# EAGLE schematic isp (EAGLE 9.6.2)
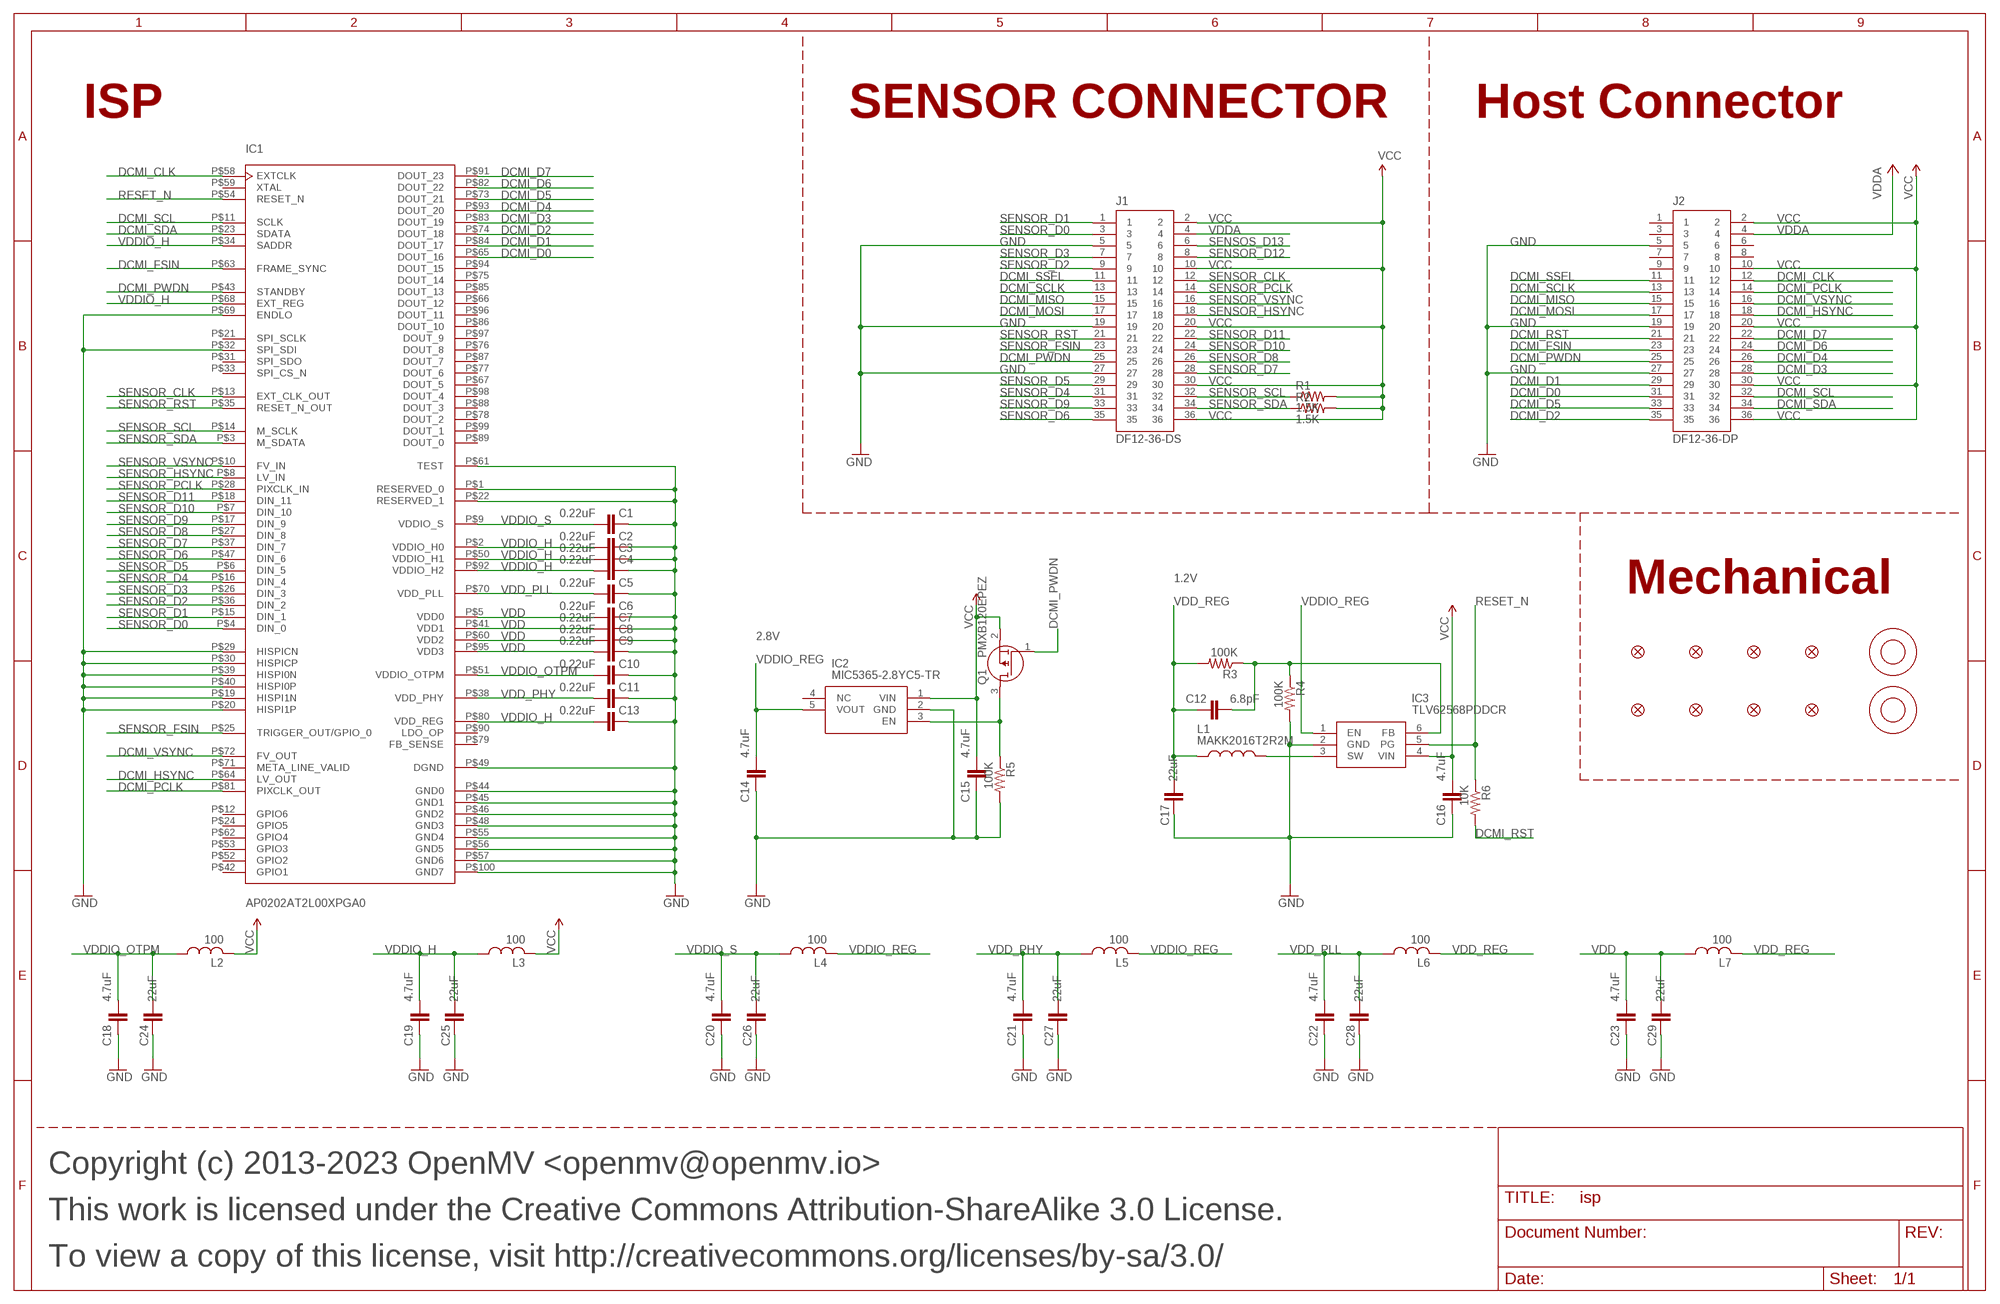
[diagram p0: schematic, sheet 1]

## Parts
C1  0.22uF  C-EUC0201  [C0201]
C2  0.22uF  C-EUC0201  [C0201]
C3  0.22uF  C-EUC0201  [C0201]
C4  0.22uF  C-EUC0201  [C0201]
C5  0.22uF  C-EUC0201  [C0201]
C6  0.22uF  C-EUC0201  [C0201]
C7  0.22uF  C-EUC0201  [C0201]
C8  0.22uF  C-EUC0201  [C0201]
C9  0.22uF  C-EUC0201  [C0201]
C10  0.22uF  C-EUC0201  [C0201]
C11  0.22uF  C-EUC0201  [C0201]
C12  6.8pF  CAP_0402  [0402]
C13  0.22uF  C-EUC0201  [C0201]
C14  4.7uF  CAP_0402  [0402]
C15  4.7uF  CAP_0402  [0402]
C16  4.7uF  CAP_0402  [0402]
C17  22uF  22UF-0805-6.3V-20%  [0805]
C18  4.7uF  CAP_0402  [0402]
C19  4.7uF  CAP_0402  [0402]
C20  4.7uF  CAP_0402  [0402]
C21  4.7uF  CAP_0402  [0402]
C22  4.7uF  CAP_0402  [0402]
C23  4.7uF  CAP_0402  [0402]
C24  22uF  22UF-0805-6.3V-20%  [0805]
C25  22uF  22UF-0805-6.3V-20%  [0805]
C26  22uF  22UF-0805-6.3V-20%  [0805]
C27  22uF  22UF-0805-6.3V-20%  [0805]
C28  22uF  22UF-0805-6.3V-20%  [0805]
C29  22uF  22UF-0805-6.3V-20%  [0805]
FD1  FIDUCIAL1X2  [FIDUCIAL-1X2]
FD2  FIDUCIAL1X2  [FIDUCIAL-1X2]
FD3  FIDUCIAL1X2  [FIDUCIAL-1X2]
FD4  FIDUCIAL1X2  [FIDUCIAL-1X2]
FD5  FIDUCIAL1X2  [FIDUCIAL-1X2]
FD6  FIDUCIAL1X2  [FIDUCIAL-1X2]
FD7  FIDUCIAL1X2  [FIDUCIAL-1X2]
FD8  FIDUCIAL1X2  [FIDUCIAL-1X2]
IC1  AP0202AT2L00XPGA0  [AP0202AT2L00XPGA0]
IC2  MIC5365-2.8YC5-TR  [SOT65P210X110-5N]
IC3  TLV62568PDDCR  [SOT95P280X110-6N]
J1  DF12-36-DS  [DF12-36-DS]
J2  DF12-36-DP  [DF12-36-DP]
L1  MAKK2016T2R2M  [INDC2016X100N]
L2  100  INDUCTOR_0402  [0402]
L3  100  INDUCTOR_0402  [0402]
L4  100  INDUCTOR_0402  [0402]
L5  100  INDUCTOR_0402  [0402]
L6  100  INDUCTOR_0402  [0402]
L7  100  INDUCTOR_0402  [0402]
M1  9774030151R  [9774030151R]
M2  9774030151R  [9774030151R]
Q1  PMXB120EPEZ  [PMXB120EPEZ]
R1  1.5K  R-US_R0402  [R0402]
R2  1.5K  R-US_R0402  [R0402]
R3  100K  R-US_R0402  [R0402]
R4  100K  R-US_R0402  [R0402]
R5  100K  R-US_R0402  [R0402]
R6  10K  R-US_R0402  [R0402]

## Nets
DCMI_CLK [signal]: IC1.P$58(EXTCLK) J2.12
DCMI_D0 [signal]: IC1.P$65(DOUT_16) J2.31
DCMI_D1 [signal]: IC1.P$84(DOUT_17) J2.29
DCMI_D2 [signal]: IC1.P$74(DOUT_18) J2.35
DCMI_D3 [signal]: IC1.P$83(DOUT_19) J2.28
DCMI_D4 [signal]: IC1.P$93(DOUT_20) J2.26
DCMI_D5 [signal]: IC1.P$73(DOUT_21) J2.33
DCMI_D6 [signal]: IC1.P$82(DOUT_22) J2.24
DCMI_D7 [signal]: IC1.P$91(DOUT_23) J2.22
DCMI_FSIN [signal]: IC1.P$63(FRAME_SYNC) J2.23
DCMI_HSYNC [signal]: IC1.P$64(LV_OUT) J2.18
DCMI_MISO [signal]: J1.15 J2.15
DCMI_MOSI [signal]: J1.17 J2.17
DCMI_PCLK [signal]: IC1.P$81(PIXCLK_OUT) J2.14
DCMI_PWDN [signal]: IC1.P$43(STANDBY) J1.25 J2.25 Q1.1(G)
DCMI_PWDN_INT [signal]: IC2.3(EN) Q1.3(D) R5.1
DCMI_RST [signal]: J2.21 R6.2
DCMI_SCL [signal]: IC1.P$11(SCLK) J2.32
DCMI_SCLK [signal]: J1.13 J2.13
DCMI_SDA [signal]: IC1.P$23(SDATA) J2.34
DCMI_SSEL [signal]: J1.11 J2.11
DCMI_VSYNC [signal]: IC1.P$72(FV_OUT) J2.16
FB [pwr]: C12.2 IC3.6(FB) R3.1 R4.1
GND [gnd]: C1.1 C2.1 C3.1 C4.1 C5.1 C6.1 C7.1 C8.1 C9.1 C10.1 C11.1 C13.1 C14.1 C15.1 C16.1 C17.1 C18.1 C19.1 C20.1 C21.1 C22.1 C23.1 C24.1 C25.1 C26.1 C27.1 C28.1 C29.1 IC1.P$1(RESERVED_0) IC1.P$19(HISPI1N) IC1.P$20(HISPI1P) IC1.P$22(RESERVED_1) IC1.P$29(HISPICN) IC1.P$30(HISPICP) IC1.P$32(SPI_SDI) IC1.P$39(HISPI0N) IC1.P$40(HISPI0P) IC1.P$44(GND0) IC1.P$45(GND1) IC1.P$46(GND2) IC1.P$48(GND3) IC1.P$49(DGND) IC1.P$55(GND4) IC1.P$56(GND5) IC1.P$57(GND6) IC1.P$61(TEST) IC1.P$69(ENDLO) IC1.P$100(GND7) IC2.2(GND) IC3.2(GND) J1.5 J1.19 J1.27 J2.5 J2.19 J2.27 R4.2 R5.2
RESET_N [signal]: IC1.P$54(RESET_N) IC3.5(PG) R6.1
SENSOR_CLK [signal]: IC1.P$13(EXT_CLK_OUT) J1.12
SENSOR_D0 [signal]: IC1.P$4(DIN_0) J1.3
SENSOR_D1 [signal]: IC1.P$15(DIN_1) J1.1
SENSOR_D2 [signal]: IC1.P$36(DIN_2) J1.9
SENSOR_D3 [signal]: IC1.P$26(DIN_3) J1.7
SENSOR_D4 [signal]: IC1.P$16(DIN_4) J1.31
SENSOR_D5 [signal]: IC1.P$6(DIN_5) J1.29
SENSOR_D6 [signal]: IC1.P$47(DIN_6) J1.35
SENSOR_D7 [signal]: IC1.P$37(DIN_7) J1.28
SENSOR_D8 [signal]: IC1.P$27(DIN_8) J1.26
SENSOR_D9 [signal]: IC1.P$17(DIN_9) J1.33
SENSOR_D10 [signal]: IC1.P$7(DIN_10) J1.24
SENSOR_D11 [signal]: IC1.P$18(DIN_11) J1.22
SENSOR_D12 [signal]: J1.8
SENSOR_FSIN [signal]: IC1.P$25(TRIGGER_OUT/GPIO_0) J1.23
SENSOR_HSYNC [signal]: IC1.P$8(LV_IN) J1.18
SENSOR_PCLK [signal]: IC1.P$28(PIXCLK_IN) J1.14
SENSOR_RST [signal]: IC1.P$35(RESET_N_OUT) J1.21
SENSOR_SCL [signal]: IC1.P$14(M_SCLK) J1.32 R1.1
SENSOR_SDA [signal]: IC1.P$3(M_SDATA) J1.34 R2.1
SENSOR_VSYNC [signal]: IC1.P$10(FV_IN) J1.16
SENSOS_D13 [signal]: J1.6
SW [pwr]: IC3.3(SW) L1.2
VCC [pwr]: C15.2 C16.2 IC2.1(VIN) IC3.4(VIN) J1.2 J1.10 J1.20 J1.30 J1.36 J2.2 J2.10 J2.20 J2.30 J2.36 L2.2 L3.2 Q1.2(S) R1.2 R2.2
VDD [pwr]: C6.2 C7.2 C8.2 C9.2 C23.2 C29.2 IC1.P$5(VDD0) IC1.P$41(VDD1) IC1.P$60(VDD2) IC1.P$95(VDD3) L7.1
VDD_PHY [pwr]: C11.2 C21.2 C27.2 IC1.P$38(VDD_PHY) L5.1
VDD_PLL [pwr]: C5.2 C22.2 C28.2 IC1.P$70(VDD_PLL) L6.1
VDD_REG [pwr]: C12.1 C17.2 L1.1 L6.2 L7.2 R3.2
VDDA [pwr]: J1.4 J2.4
VDDIO_H [pwr]: C2.2 C3.2 C4.2 C13.2 C19.2 C25.2 IC1.P$2(VDDIO_H0) IC1.P$34(SADDR) IC1.P$50(VDDIO_H1) IC1.P$68(EXT_REG) IC1.P$80(VDD_REG) IC1.P$92(VDDIO_H2) L3.1
VDDIO_OTPM [pwr]: C10.2 C18.2 C24.2 IC1.P$51(VDDIO_OTPM) L2.1
VDDIO_REG [pwr]: C14.2 IC2.5(VOUT) IC3.1(EN) L4.2 L5.2
VDDIO_S [pwr]: C1.2 C20.2 C26.2 IC1.P$9(VDDIO_S) L4.1
Unconnected: IC1.P$12(GPIO6) IC1.P$21(SPI_SCLK) IC1.P$24(GPIO5) IC1.P$31(SPI_SDO) IC1.P$33(SPI_CS_N) IC1.P$42(GPIO1) IC1.P$52(GPIO2) IC1.P$53(GPIO3) IC1.P$59(XTAL) IC1.P$62(GPIO4) IC1.P$66(DOUT_12) IC1.P$67(DOUT_5) IC1.P$71(META_LINE_VALID) IC1.P$75(DOUT_14) IC1.P$76(DOUT_8) IC1.P$77(DOUT_6) IC1.P$78(DOUT_2) IC1.P$79(FB_SENSE) IC1.P$85(DOUT_13) IC1.P$86(DOUT_10) IC1.P$87(DOUT_7) IC1.P$88(DOUT_3) IC1.P$89(DOUT_0) IC1.P$90(LDO_OP) IC1.P$94(DOUT_15) IC1.P$96(DOUT_11) IC1.P$97(DOUT_9) IC1.P$98(DOUT_4) IC1.P$99(DOUT_1) IC2.4(NC) J2.1 J2.3 J2.6 J2.7 J2.8 J2.9

## Notes on the sheet
- ISP | SENSOR CONNECTOR | Host Connector
- 1.2V
- Mechanical
- 2.8V
- Copyright (c) 2013-2023 OpenMV <openmv@openmv.io>
- This work is licensed under the Creative Commons Attribution-ShareAlike 3.0 License.
- To view a copy of this license, visit http://creativecommons.org/licenses/by-sa/3.0/

## Library data of the parts
C1-C11 C13 = rcl:C-EU: CAPACITOR, European symbol; MPN: GRM033R60J224ME15D; SPICEPREFIX: C
C12 = 0402:CAP_0402: 0402 (1005 Metric) Nick Garner - TeleSense; MPN: GRM1555C1H6R8DA01D
C14-C16 C18-C23 = 0402:CAP_0402: 0402 (1005 Metric) Nick Garner - TeleSense; MPN: JMK105BBJ475MV-F
C17 C24-C29 = SparkFun-Capacitors:22UF: 22µF ceramic capacitors A capacitor is a passive two-terminal electrical component used to store electrical energy temporarily in an electric field.; MPN: CL21A226MQQNNNE; PROD_ID: CAP-08402
FD1-FD8 = SparkFun-Aesthetics:FIDUCIAL: Fiducial Alignment Points Point-of-reference for pick-and-place machines and other optical instruments.
IC1 = AP0202AT2L00XPGA0:AP0202AT2L00XPGA0; MPN: AP0202AT2L00XPGA0-DR
IC2 = MIC5365-2.8YC5-TR:MIC5365-2.8YC5-TR: IC REG LINEAR 2.8V 150MA SC70-5 Source: Datasheet <http://www.microchip.com/mymicrochip/filehandler.aspx?ddocname=en580022>; DESCRIPTION: IC REG LINEAR 2.8V 150MA SC70-5; HEIGHT: 1.1mm; MANUFACTURER_NAME: Microchip; MANUFACTURER_PART_NUMBER: MIC5365-2.8YC5-TR; MOUSER_PART_NUMBER: 998-MIC5365-2.8YC5TR; MOUSER_PRICE-STOCK: https://www.mouser.co.uk/ProductDetail/Microchip-Technology-Atmel/MIC5365-2.8YC5-TR?qs=U6T8BxXiZAX3mJDSWJyjVA%3D%3D; MPN: MIC5365-2.8YC5-TR
IC3 = TLV62568PDDCR:TLV62568PDDCR: 2.5V-5.5V input, 1A high efficiency step-down buck converter in SOT23 and SOT563 package Source: Datasheet <http://www.ti.com/lit/gpn/tlv62568>; DESCRIPTION: 2.5V-5.5V input, 1A high efficiency step-down buck converter in SOT23 and SOT563 package; HEIGHT: 1.1mm; MANUFACTURER_NAME: Texas Instruments; MANUFACTURER_PART_NUMBER: TLV62568PDDCR; MOUSER_PART_NUMBER: 595-TLV62568PDDCR; MOUSER_PRICE-STOCK: https://www.mouser.co.uk/ProductDetail/Texas-Instruments/TLV62568PDDCR?qs=1mbolxNpo8f1FPchIXcxyQ%3D%3D; MPN: TLV62568PDDCR
J1 = DF12-36-DS:DF12-36-DS; MPN: DF12NB-36DS-0.5V(51)
J2 = DF12NB(3.0)-36DP-0.5V(51):DF12-36-DP; MPN: DF12NB(3.0)-36DP-0.5V(51)
L1 = MAKK2016T2R2M:MAKK2016T2R2M: INDUCTOR, METAL CORE Check availability <https://pricing.snapeda.com/parts/MAKK2016T2R2M/Taiyo%20Yuden/view-part?ref=eda>; AVAILABILITY: In Stock; DESCRIPTION: 2.2 µH Shielded Drum Core, Wirewound Inductor 1.5 A 160mOhm Max 0806 (2016 Metric); MF: Taiyo Yuden; MP: MAKK2016T2R2M; MPN: MAKK2016T2R2M; PACKAGE: 2016 Taiyo Yuden; PRICE: None; PURCHASE-URL: https://pricing.snapeda.com/search/part/MAKK2016T2R2M/?ref=eda
L2-L7 = 0402:INDUCTOR_0402; MPN: MFBM1V1005-101-R
M1 M2 = 9774030151R:9774030151R; MPN: 9774030151R
Q1 = PMXB120EPEZ:PMXB120EPEZ: MOSFET 30 V, P-channel Trench MOSFET Source: Datasheet <https://componentsearchengine.com/Datasheets/1/PMXB120EPEZ.pdf>; DESCRIPTION: MOSFET 30 V, P-channel Trench MOSFET; HEIGHT: 0.4mm; MANUFACTURER_NAME: Nexperia; MANUFACTURER_PART_NUMBER: PMXB120EPEZ; MOUSER_PART_NUMBER: 771-PMXB120EPEZ; MOUSER_PRICE-STOCK: https://www.mouser.co.uk/ProductDetail/Nexperia/PMXB120EPEZ?qs=gNSudQoqUYCYLaOobF3dPA%3D%3D; MPN: PMXB120EPEZ
R1 R2 = rcl:R-US_: RESISTOR, American symbol; MPN: RC0402FR-131K5L; SPICEPREFIX: R
R3-R5 = rcl:R-US_: RESISTOR, American symbol; MPN: AC0402FR-07100KL; SPICEPREFIX: R
R6 = rcl:R-US_: RESISTOR, American symbol; MPN: AC0402FR-1310KL; SPICEPREFIX: R

## Net classes
0 default: width 0.076 mm, drill 0.102 mm, clearance 0.076 mm
2 gnd: width 0.076 mm, drill 0.102 mm, clearance 0.076 mm to class 0, clearance 0.076 mm to class 1, clearance 0.127 mm
3 pwr: width 0.076 mm, drill 0.102 mm, clearance 0.076 mm to class 0, clearance 0.076 mm to class 1, clearance 0.076 mm to class 2, clearance 0.127 mm
4 signal: width 0.076 mm, drill 0.102 mm, clearance 0.076 mm to class 0, clearance 0.076 mm to class 1, clearance 0.076 mm to class 2, clearance 0.076 mm to class 3, clearance 0.127 mm